# EasyEDA Pro project 4090_Portable_Fan.epro, board PCB1_1
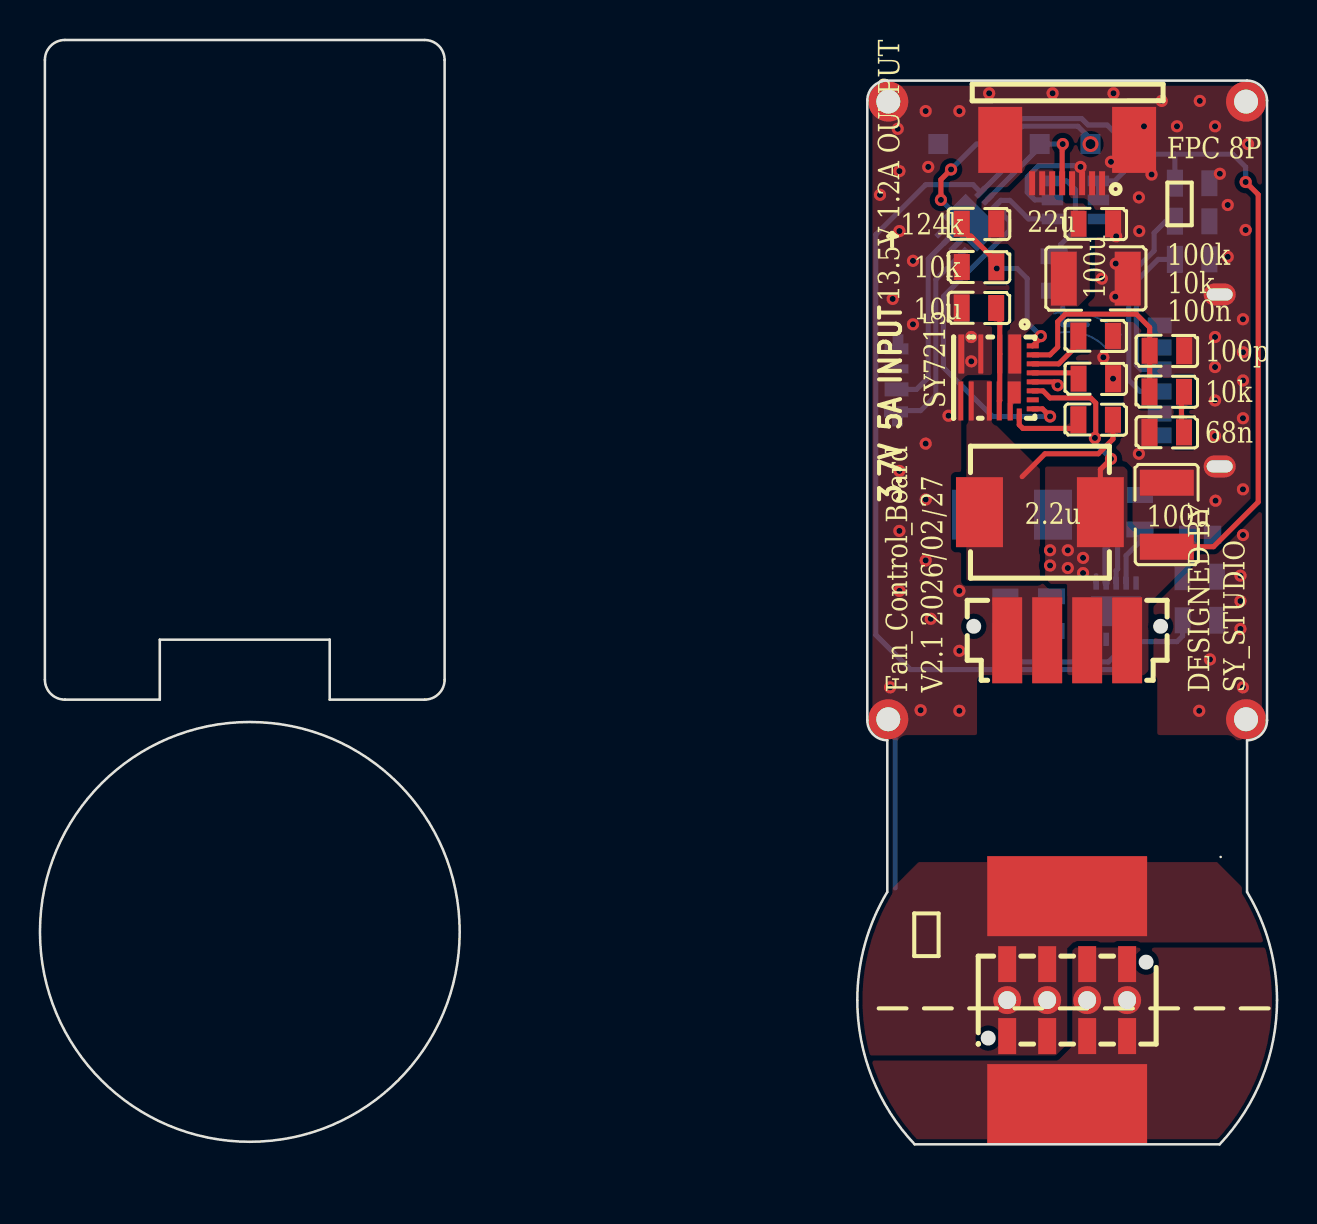
[diagram p12: board, top side]
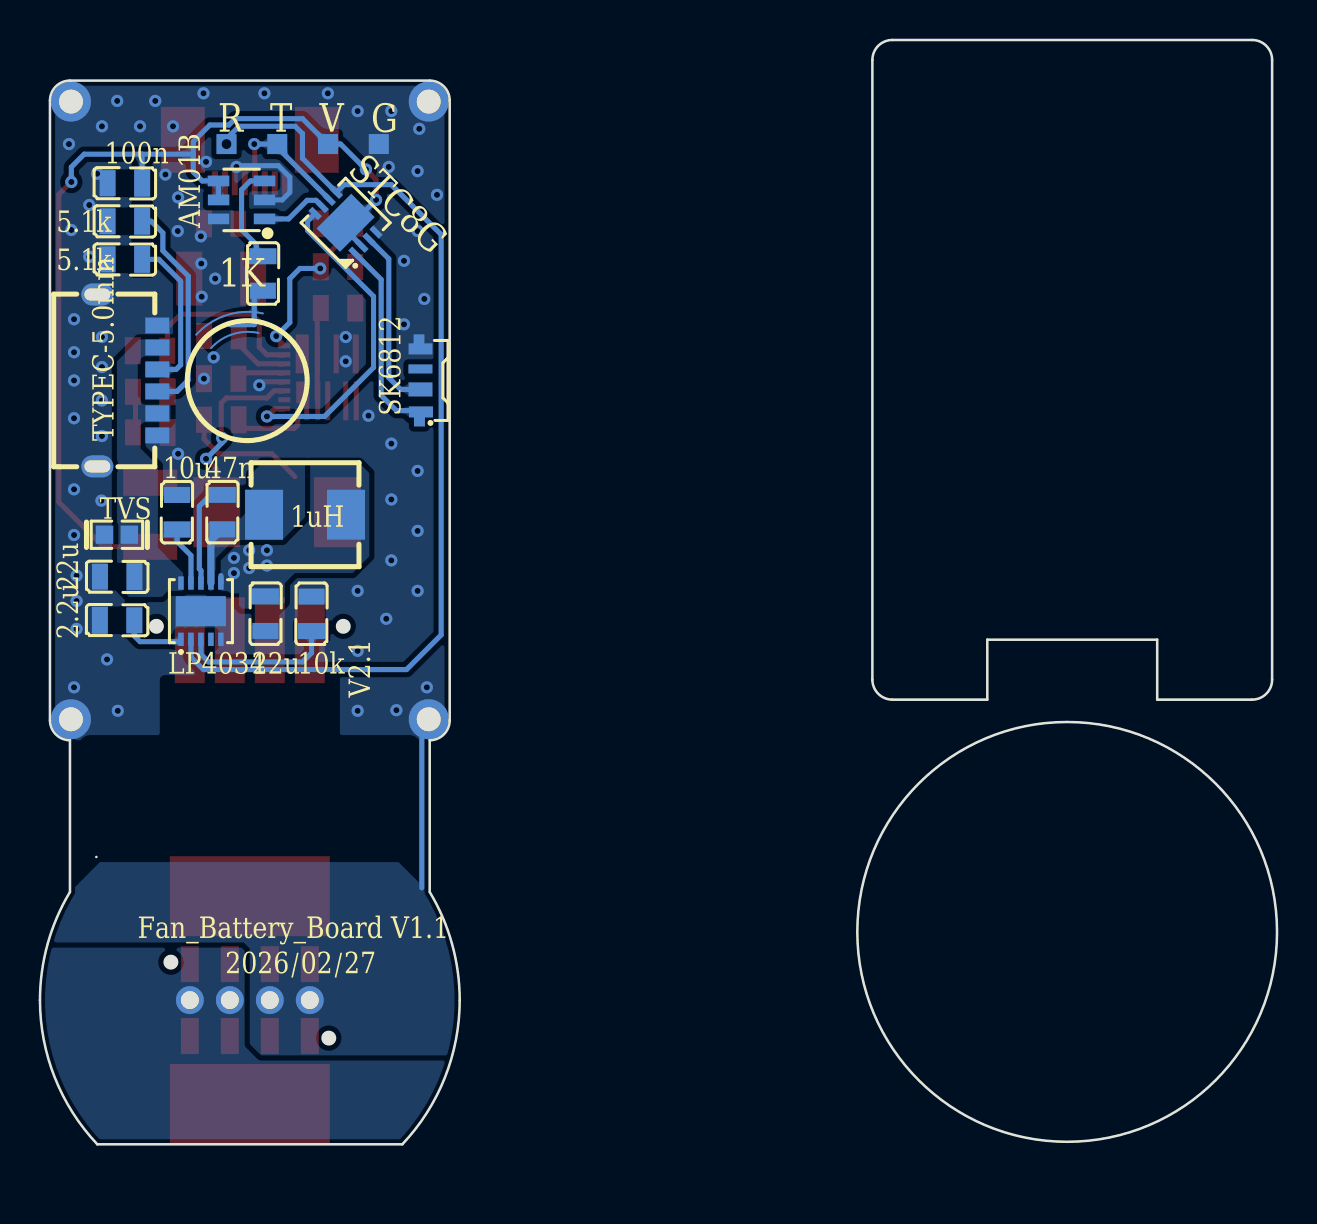
[diagram p13: board, bottom side, seen from below]

Outline 61.89 x 55.25 mm; copper layers: Top Layer, Bottom Layer. Coordinates in mm from the lower left corner of the outline.
Outline path: circle c10.5,10.63 r10.5 ; 0.25,54.25 arc(0.54,54.95) 1.25,55.25 19.25,55.25 arc(19.95,54.95) 20.25,54.25 20.25,23.25 arc(19.95,22.54) 19.25,22.25 14.5,22.25 14.5,25.25 6,25.25 6,22.25 1.25,22.25 arc(0.54,22.54) 0.25,23.25 0.25,54.25 ; 40.89,7.21 arc(41.28,10.02) 42.39,12.62 42.39,20.21 arc(41.69,20.51) 41.39,21.21 41.39,52.21 arc(41.69,52.92) 42.39,53.21 60.39,53.21 arc(61.1,52.92) 61.39,52.21 61.39,21.21 arc(61.1,20.51) 60.39,20.21 60.39,12.62 arc(61.51,10.02) 61.89,7.21 arc(61.15,3.33) 59.02,0 43.76,0 arc(41.64,3.33) 40.89,7.21
Stack: Top Layer 0.035mm / Dielectric1 1.11mm FR4 er 4.5 / Bottom Layer 0.035mm

## Design rules (mm)
spacing copperThickness1oz (default): track to track 0.102, other pairs 0.152 to 0.3
spacing copperThickness2oz: track to track 0.203, other pairs 0.152 to 0.3
spacing Plane_innerPlane: track to track 0.102, other pairs 0.152 to 0.3
spacing Copper_copperRegion: track to track 0.102, other pairs 0.152 to 0.3
track width copperThickness1oz (default): min 0.127, default 0.254, max 2.54
track width copperThickness2oz: min 0.203, default 0.254, max 2.54
differential pair differentialPair (default): width min 0.127, default 0.254, max 2.54; gap min 0.152, default 0.152
net VBAT+ uses copperRegion_copperThickness1oz
net GND uses copperRegion_copperThickness1oz
net VBUS uses copperRegion_copperThickness1oz
pour e232 uses Copper_copperRegion, copperRegion_Copper_copperRegion
net $1N43207 uses copperRegion_copperThickness1oz
net VBAT uses copperRegion_copperThickness1oz
net $1N43171 uses copperRegion_copperThickness1oz
net BS uses copperRegion_copperThickness1oz
pour e263 uses Copper_copperRegion, copperRegion_Copper_copperRegion
pour e266 uses Copper_copperRegion, copperRegion_Copper_copperRegion
net GND1 uses copperRegion_copperThickness1oz

## Placement (name value [footprint] x y rotation side)
C1  100nF  [0805_S]  57.65 48.13 90 bottom
C2  100pF  [0805_S]  56.38 39.75 90 top
C3  68nF  [0805_S]  56.38 35.56 270 top
C4  100uF  [C1210]  56.38 31.5 270 top
C5  100nF  [0805_S]  52.82 36.2 270 top
C6  10uF  [0805_S]  46.98 41.78 270 top
C7  100uF  [C1210]  52.82 43.31 180 top
C8  22uF  [0805_S]  52.82 46.1 90 top
C9  22uF  [0805_S]  58.03 28.45 90 bottom
C10  2.2uF  [0805_S]  58.03 26.16 270 bottom
C11  10uF  [0805_S]  54.98 31.62 180 bottom
C12  47nF  [0805_S]  52.82 31.62 0 bottom
C13  22uF  [0805_S]  50.66 26.54 0 bottom
CON1  GT-BTR20004-0250A-005A  [CONN-SMD_GT-BTR20004-0250A-005A]  51.39 25.21 180 top
CON2  GT-BTP20004-0280A-009A  [CONN-TH_GT-BTP20004-0280A-009A]  51.39 7.21 0 top
FPC1  AFC07-S08ECA-00  [FPC-SMD_P0.5-8P_LCS-SH-H2.0]  51.39 49.16 0 top
L1  2.2uH  [IND-SMD_L7.0-W6.6_MCW-0650-220]  50.03 31.62 180 top
L2  1uH  [IND-SMD_L5.4-W5.2_FXL0530]  48.63 31.5 180 bottom
LED1  SK6812SIDE-A  [LED-SMD_4P-L4.0-W1.6-L]  42.84 38.21 90 bottom
NOREF  -  [Pad_e141]  52.56 50.04 180 top
NOREF#2  -  [Pad_e177]  42.44 21.26 270 top
NOREF#3  -  [Pad_e471]  51.39 2.01 0 top
NOREF#4  -  [Pad_e140]  50.02 50.04 180 top
NOREF#5  -  [Pad_e179]  60.34 52.16 270 top
NOREF#6  -  [Pad_e178]  60.34 21.26 270 top
NOREF#7  -  [Pad_e139]  47.48 50.04 180 top
NOREF#8  -  [Pad_e176]  42.44 52.16 270 top
NOREF#9  -  [Pad_e470]  51.39 12.41 0 top
NOREF#10  -  [Pad_e138]  44.94 50.04 180 top
R1  10K  [0805_S]  56.38 37.59 270 top
R2  1K  [0805_S]  50.79 43.56 0 bottom
R3  10K  [0805_S]  46.98 43.94 90 top
R4  124K  [0805_S]  46.98 46.1 90 top
R6  100K  [0805_S]  52.82 40.39 270 top
R7  10K  [0805_S]  52.82 38.35 90 top
R8  10k  [0805_S]  48.25 26.54 180 bottom
R9  5.1K  [0805_S]  57.65 44.32 90 bottom
R10  5.1K  [0805_S]  57.65 46.23 90 bottom
STC1  STC8G1K08A-36I-DFN8  [DFN-8_L3.0-W3.0-P0.50-BL-EP]  46.6 46.1 135 bottom
TVS1  PESD0603-240  [D0603-BI]  58.04 30.49 180 bottom
U1  AM01B  [SOT-23-6_L2.9-W1.6-P0.95-LS2.8-BL]  51.81 47.24 90 bottom
U2  -  [F9-10-6-0.4喇叭口无针触摸弹簧]  51.39 38.21 162.3 bottom
U3  SY7215ARDC  [QFN-18_L4.0-W4.0_SY7215ARDC]  47.87 38.23 270 top
U4  LP4034QVF  [DFN-10_L3.0-W3.0-P0.50-BL-EP2.5]  53.84 26.67 180 bottom
USBC1  TYPE-C 6P WTL5.0 108  [USB-C-SMD_TYPE-C-6P-WTL5.0-108]  57.52 38.21 270 bottom

## Footprints (pads in the part's own frame, mm; a bottom-side part is the same pattern mirrored in y, then rotated)
0805_S
  rect 1.3x0.8 smd: 1(-0.052,0.86)
  rect 1.35x0.8 smd: 2(-0.052,-0.867)
C1210
  rect 1.3x2.7 smd: 1(-1.6,0) 2(1.6,0)
CONN-SMD_GT-BTR20004-0250A-005A
  rect 1.5x4.3 smd: 1(-3,0) 2(-1,0) 3(1,0) 4(3,0)
CONN-TH_GT-BTP20004-0280A-009A
  rect 0.9x1.8 smd: 1(-3,1.8) 1(-3,-1.8) 2(-1,1.8) 2(-1,-1.8) 3(1,1.8) 3(1,-1.8) 4(3,1.8) 4(3,-1.8)
  round 1.4 hole 0.9: 1(-3,0) 2(-1,0) 3(1,0) 4(3,0)
D0603-BI
  rect 0.873x0.907 smd: 1(-0.622,0) 2(0.622,0)
DFN-8_L3.0-W3.0-P0.50-BL-EP
  rect 0.28x0.665 smd: 1(-0.75,-1.407) 2(-0.25,-1.407) 3(0.25,-1.407) 4(0.75,-1.407) 5(0.75,1.407) 6(0.25,1.407) 7(-0.25,1.407) 8(-0.75,1.407)
  rect 2.45x1.65 smd: 9(0,0)
DFN-10_L3.0-W3.0-P0.50-BL-EP2.5
  rect 0.28x0.665 smd: 1(-1,-1.407) 2(-0.5,-1.407) 3(0,-1.407) 4(0.5,-1.407) 5(1,-1.407) 6(1,1.407) 7(0.5,1.407) 8(0,1.407) 9(-0.5,1.407) 10(-1,1.407)
  rect 2.5x1.5 smd: 11(0,0)
F9-10-6-0.4喇叭口无针触摸弹簧
  custom 3.5x1.335 smd: 1(-0.111,2.965)
FPC-SMD_P0.5-8P_LCS-SH-H2.0
  rect 0.3x1.2 smd: 1(1.748,-1.084) 2(1.248,-1.084) 3(0.748,-1.084) 4(0.248,-1.084) 5(-0.252,-1.084) 6(-0.752,-1.084) 7(-1.252,-1.084) 8(-1.754,-1.083)
  rect 2.2x3.3 smd: 9(3.35,1.084) 10(-3.35,1.084)
IND-SMD_L5.4-W5.2_FXL0530
  rect 1.9x2.5 smd: 1(-2.05,0) 2(2.05,0)
IND-SMD_L7.0-W6.6_MCW-0650-220
  rect 2.35x3.5 smd: 1(-3.025,0) 2(3.025,0)
LED-SMD_4P-L4.0-W1.6-L
  custom 1x1.2 smd: 1(-1.8,-0.013) 4(1.8,0.013)
  custom 0.7x1.2 smd: 2(-0.45,0.013)
  custom 0.45x1.2 smd: 3(0.575,0.013)
Pad_e138
  rect 1x1 smd far side: 2(0,0)
Pad_e139
  rect 1x1 smd far side: 2(0,0)
Pad_e140
  rect 1x1 smd far side: 2(0,0)
Pad_e141
  rect 1x1 smd far side: 2(0,0)
Pad_e176
  round 2 hole 1.2: 1(0,0)
Pad_e177
  round 2 hole 1.2: 1(0,0)
Pad_e178
  round 2 hole 1.2: 1(0,0)
Pad_e179
  round 2 hole 1.2: 1(0,0)
Pad_e470
  rect 8x4 smd: 2(0,0)
Pad_e471
  rect 8x4 smd: 2(0,0)
QFN-18_L4.0-W4.0_SY7215ARDC
  rect 1.95x0.65 smd: 1(-1.31,0.9)
  rect 1.95x0.25 smd: 2(-1.31,0.15) 3(-1.31,-0.8) 5(1.04,-1.8) 6(1.04,-1.275) 7(1.04,-0.375) 8(1.04,0.125)
  rect 1.95x0.3 smd: 4(-1.31,-1.775)
  custom 1.95x0.65 smd: 9(1.04,0.875)
  rect 0.6x0.25 smd: 10(1.715,1.125)
  rect 0.25x0.6 smd: 11(1.435,1.8) 12(0.985,1.8) 13(0.535,1.8) 14(0.085,1.8) 15(-0.365,1.8) 16(-0.815,1.8) 17(-1.265,1.8) 18(-1.715,1.8)
SOT-23-6_L2.9-W1.6-P0.95-LS2.8-BL
  rect 0.532x1.072 smd: 1(-0.95,-1.149) 2(0,-1.149) 3(0.95,-1.149) 4(0.95,1.149) 5(0,1.149) 6(-0.95,1.149)
USB-C-SMD_TYPE-C-6P-WTL5.0-108
  oval 1.1x1.6 hole 0.6x1.3: 7(-4.3,-1.5) 8(4.3,-1.5)
  rect 0.8x1.2 smd: A5(-0.55,1.5) A9(1.65,1.5) A12(2.75,1.5) B5(0.55,1.5) B9(-1.65,1.5) B12(-2.75,1.5)

## Nets
13.5V: C7.2 C8.1 FPC1.6 FPC1.7 FPC1.8 R4.2 U3.1 U3.9
GND: C1.1 C2.2 C3.2 C4.1 C6.2 C7.1 C8.2 C9.1 C10.2 C11.1 C13.1 CON1.3 CON1.4 FPC1.1 FPC1.2 FPC1.3 FPC1.4 FPC1.9 FPC1.10 LED1.4 NOREF#2.1 NOREF#5.1 NOREF#6.1 NOREF#8.1 NOREF#10.2 R3.1 R6.1 R7.2 R8.1 R9.1 R10.1 STC1.4 TVS1.1 U1.2 U1.6 U3.3 U3.4 U3.5 U3.14 U4.5 U4.11 USBC1.7 USBC1.8 USBC1.A12 USBC1.B12
GND1: CON2.3 CON2.4 NOREF#3.2
VBAT: C1.2 C4.2 C13.2 CON1.1 CON1.2 L1.1 L2.2 NOREF#7.2 STC1.2 STC1.9 U1.4 U1.5 U3.13 U4.6
VBAT+: CON2.1 CON2.2 NOREF#9.2
VBUS: C9.2 TVS1.2 U4.10 USBC1.A9 USBC1.B9
BD: C6.1 U3.2 U3.8
BS: C5.2 U3.10
CHRG: NOREF.2 STC1.5 U4.2
COMP: C2.1 R1.2 U3.17
KEY_INT0: STC1.7 U1.1
POWER_ON: STC1.8 U3.11
PWM: FPC1.5 NOREF#4.2 STC1.6
WS2812_PWR: LED1.2 STC1.3
WS2812_SPI: LED1.1 STC1.1
$1N19622: R9.2 USBC1.A5
$1N19624: R10.2 USBC1.B5
$1N43171: C5.1 L1.2 U3.6 U3.7
$1N43181: R6.2 U3.16
$1N43183: R3.2 R4.1 U3.18
$1N43190: R7.1 U3.15
$1N43193: C3.1 R1.1
$1N43198: R2.2 U1.3
$1N43200: R2.1 U2.1
$1N43207: C12.1 L2.1 U4.7
$1N43212: C12.2 U4.8
$1N43213: C11.2 U4.9
$1N43216: R8.2 U4.3
$1N43221: C10.1 U4.1

Pads without a net: LED1 3; U3 12; U4 4

## Via types
v1: diameter 0.61, hole 0.305, Top Layer to Bottom Layer, 83 vias
v2: diameter 0.8, hole 0.5, Top Layer to Bottom Layer, 1 via

## Routing (per net, layer and track width the routed paths; a pad name or vN(x,y) marks a point on that pad's centre or on a via; arc(x,y) is an arc through that point)
GND: length 15.1
  Top Layer w0.254: v1(50.92,37.97) 50.75,38.14 49.67,38.14
  Bottom Layer w0.254: 42.79,12.83 42.79,20.92 NOREF#2.1 ; U1.2 49.78,47.24 49.4,47.63 49.4,48.39 49.97,48.96 51.87,48.96 52.06,48.77
  vias: v1(42.03,47.5) v1(42.54,22.86) v1(42.66,42.29) v1(42.92,50.8) v1(43,48.69) v1(43,45.69) v1(43,33.69) v1(43,30.69) v1(43,27.69) v1(43.68,44.2) v1(43.68,41.02) v1(44.06,21.72) v1(44.31,51.69) v1(44.31,35.05) v1(44.31,32.26) v1(44.31,29.21) v1(44.44,48.9) v1(44.57,26.29) v1(45.46,36.45) v1(46,51.69) v1(46,27.69) v1(46,24.69) v1(46,21.69) v1(46.6,40.39) v1(46.6,39.17) v1(47.49,52.58) v1(50.66,52.58) v1(52.06,48.9) v1(53.13,43.31) v1(53.21,39.37) v1(53.59,49.15) v1(53.71,52.58) v1(53.69,38.3) v1(53.82,44.06) v1(53.8,42.4) v1(53.84,45.42) v1(54.98,47.37) v1(55,45.69) v1(54.98,34.54) v1(55.24,50.93) v1(55.62,48.51) v1(56.13,52.2) v1(56.89,50.93) v1(58.03,52.2) v1(58,21.69) v1(58.54,24.26) v1(58.79,50.93) v1(58.79,40.39) v1(58.79,38.88) v1(58.79,37.21) v1(58.79,35.43) v1(58.82,32.2) v1(59.03,48.55) v1(59.43,46.99) v1(59.43,44.4) v1(60.06,28.45) v1(60.06,27.18) v1(60.06,25.78) v1(60.19,41.28) v1(60.19,39.62) v1(60.19,38.21) v1(60.19,36.32) v1(60.19,32.77) v1(60.19,30.48) v1(60.19,22.86) v1(60.32,45.74) v1(60.44,50.04)
VBAT: length 61.2
  Top Layer w0.254: v1(52.78,35.34) 52.82,35.38 52.82,37.08 52.57,37.34 50.54,37.34 50.18,37.69 49.67,37.69 ; 54.98,23.75 54.39,24.34 CON1.1 ; v1(53.59,34.29) 53.06,33.76 L1.1 ; v1(45.59,48.77) 45.08,48.26 v1(45.08,47.24) ; C4.2 58.72,29.9 60.95,32.13 60.95,47.51 v1(60.32,48.14)
  Bottom Layer w0.254: v1(45.08,47.24) 46.22,46.1 STC1.9 46.6,45.75 STC1.2 ; 54.22,49.53 54.22,48.64 53.77,48.19 52.96,48.19 U1.5 ; 54.22,49.53 56.78,49.53 ; 54.22,49.53 54.22,50.17 53.4,50.99 52.44,50.99 52.12,51.31 48.75,51.31 NOREF#7.2 46.86,50.04 v1(45.59,48.77) ; 56.78,49.53 59.68,49.53 60.32,48.89 v1(60.32,48.14) ; 56.78,49.53 C1.2 ; v1(52.78,35.34) 52.78,35.09 v1(53.59,34.29) ; U4.6 52.84,28.45
  vias: v1(50.54,29.72) v1(50.54,28.96) v1(51.43,29.72) v1(51.43,28.83) v1(52.19,29.34) v1(52.19,28.58)
BD: length 4.7
  Top Layer w0.254: U3.8 48.02,37.21 U3.2 48.02,41.66 C6.1
BS: length 3.9
  Top Layer w0.254: 49,36.51 49,35.99 49.18,35.81 51.81,35.81 51.96,35.96 C5.2
CHRG: length 49
  Bottom Layer w0.254: v2(52.56,50.04) 52.56,50.3 51.94,50.93 49.12,50.93 48.76,50.56 48.76,49.32 STC1.5 46.69,48.01 44.31,48.01 41.82,45.51 41.82,25.48 43.55,23.75 53.71,23.75 54.34,24.38 U4.2
COMP: length 10.9
  Top Layer w0.254: 49.67,39.49 50.53,39.49 50.92,39.88 50.92,41.15 51.3,41.53 54.86,41.53 55.52,40.87 C2.1 55.52,37.65 R1.2
KEY_INT0: length 3.4
  Bottom Layer w0.254: STC1.7 48.08,47.22 48.53,47.22 49.46,46.29 U1.1
POWER_ON: length 16.6
  Top Layer w0.254: 49.67,36.79 50.16,36.79 v1(50.54,36.41)
  Bottom Layer w0.254: v1(50.54,36.41) 47.66,36.41 45.2,38.86 45.2,42.42 48.51,45.72 48.51,46.19 STC1.8
PWM: length 7
  Top Layer w0.254: FPC1.5 51.14,50.01 v1(51.17,50.04)
  Bottom Layer w0.254: v1(51.17,50.04) NOREF#4.2 50.02,49.88 STC1.6
WS2812_PWR: length 9.2
  Bottom Layer w0.254: 45.43,45.28 44.44,44.3 44.44,38.35 43.85,37.76 LED1.2
WS2812_SPI: length 10.1
  Bottom Layer w0.254: STC1.1 44.82,43.26 44.82,37.47 44.06,36.7 43.12,36.7 LED1.1
$1N19622: length 7.8
  Bottom Layer w0.254: R9.2 55.95,44.27 54.86,43.18 54.86,38.99 55.08,38.76 USBC1.A5
$1N19624: length 11
  Bottom Layer w0.254: R10.2 56.33,46.18 55.75,45.59 55.75,44.7 54.47,43.43 54.47,38.23 55.04,37.66 USBC1.B5
$1N43171: length 6.3
  Top Layer w0.254: C5.1 53.68,35.28 52.95,34.54 50.28,34.54 49.14,33.4
$1N43181: length 3.1
  Top Layer w0.254: 49.67,39.04 50.97,39.04 51.96,40.03 R6.2
$1N43183: length 8.5
  Top Layer w0.254: R4.1 46.22,45.95 46.22,45.69 46.47,45.44 46.58,45.44 47.85,44.17 47.85,43.89 ; v1(50.08,40.43) 50.08,40.35 49.67,39.94
  Bottom Layer w0.254: v1(50.08,40.43) 49.4,41.11 49.4,43.31 48.89,43.82 v1(47.87,43.82)
$1N43190: length 2.4
  Top Layer w0.254: 49.67,38.59 51.67,38.59 R7.1
$1N43193: length 1.4
  Top Layer w0.254: 57.11,36.25 57.11,37.52 R1.1
$1N43198: length 4.7
  Bottom Layer w0.254: 51.07,44.65 51.07,45.01 51.81,45.75 51.81,47.75 51.37,48.19 50.66,48.19
$1N43200: length 3.3
  Bottom Layer w0.254: U2.1 51.17,41 51.17,42.55 51.02,42.7 R2.1
$1N43207: length 2.9
  Bottom Layer w0.36: C12.1 53.34,30.2 U4.7
$1N43212: length 5.3
  Bottom Layer w0.254: C12.2 53.35,32.49 53.92,31.92 53.92,28.78 53.84,28.7 U4.8
$1N43213: length 3
  Bottom Layer w0.254: 55.04,30.76 55.04,30.15 54.34,29.46 U4.9
$1N43216: length 7.7
  Bottom Layer w0.254: R8.2 48.3,24.59 48.76,24.13 53.46,24.13 53.84,24.51 U4.3
$1N43221: length 3.3
  Bottom Layer w0.254: C10.1 57.17,25.43 56.89,25.15 54.96,25.15 U4.1

## Copper pours and planes (outline as drawn; the poured copper is in the pictures)
13.5V on Top Layer: 48.38,36.2 48.38,40.64 48.76,41.02 48.76,44.7 48.42,45.04 47.66,45.04 47.11,45.59 47.11,47.13 47.6,47.63 48.51,47.63 49.52,48.64 49.52,48.77 50.66,48.77 50.9,48.53 50.9,47.47 51.31,47.07 52.19,47.07 52.52,46.74 52.52,42.5 51.75,41.73 50.86,41.73 50.15,41.02 49.45,41.02 49.1,40.67 49.1,36.24 49.06,36.2
13.5V on Top Layer: 48.53,41.23 49.9,41.23 49.9,40.39 48.53,40.39
GND on Top Layer: 41.39,53.21 61.39,53.21 61.39,20.21 41.39,20.21
GND on Bottom Layer: 41.39,53.21 61.39,53.21 61.39,20.21 41.39,20.21
GND1 on Top Layer: 41.26,4.48 51.04,4.48 51.39,4.83 51.39,9.49 52,10.1 62.54,10.1 62.73,9.91 62.73,1.91 60.7,-0.13 42.16,-0.13 41.26,0.77
GND1 on Bottom Layer: 41.21,4.58 51,4.58 51.34,4.93 51.34,9.59 51.95,10.2 62.49,10.2 62.68,10.01 62.68,2.01 60.65,-0.02 42.11,-0.02 41.21,0.88
VBAT on Top Layer: 54.98,23.21 51.39,23.21 51.39,27.98 51.33,28.04 50.57,28.04 50.03,28.58 50.03,33.64 50.3,33.91 54.23,33.91 54.41,33.73 54.41,30.95 54.87,30.49 57.72,30.49 57.73,29.29 55.45,27.01 55.45,23.68
VBAT on Bottom Layer: 45.93,34.1 48.4,34.1 48.4,31.3 49.71,29.99 52.18,29.99 53.01,29.15 53.01,27.74 52.82,27.56 51.94,27.56 51.81,27.69 51.81,27.94 51.17,28.58 46.25,28.58 45.42,29.41 45.42,33.58
VBAT on Bottom Layer: 51.94,26.92 51.81,26.8 49.96,26.8 49.65,27.11 49.65,28.07 48.96,28.76 51.2,28.76 51.33,28.9 51.65,28.58 51.68,28.58 51.94,28.32
VBAT+ on Top Layer: 60.39,14.36 62.6,12.14 62.6,10.92 61.78,10.1 51.69,10.1 51.39,9.8 51.39,5.01 50.83,4.45 39.36,4.45 39.36,11.43 42.29,14.36
VBAT+ on Bottom Layer: 60.39,14.36 62.6,12.14 62.6,10.92 61.78,10.1 51.69,10.1 51.39,9.8 51.39,5.01 50.83,4.45 39.36,4.45 39.36,11.43 42.29,14.36
VBUS on Bottom Layer: 56.94,40.26 58.04,39.16 58.04,27.99 57.44,27.38 55.79,27.38 55.49,27.69 54.73,27.69 54.73,28.58 55.24,29.08 55.24,29.08 56,29.85 56,33.95 56.86,34.81 56.86,35.97 56.76,36.07 55.49,36.07 55.36,36.2 55.36,36.96 55.49,37.08 56.63,37.08 57,37.45 57,39 56.69,39.31 55.42,39.31 55.36,39.37 55.36,40.26
$1N43171 on Top Layer: 50.03,28.32 49.9,28.19 46.35,28.19 46.35,33.78 46.35,33.79 46.35,38.11 46.47,38.23 47.62,38.23 47.74,38.1 47.74,36.07 50.03,33.78
$1N43207 on Bottom Layer: 48.63,34.1 50.77,34.1 51.33,33.54 51.33,31.84 51.94,31.24 53.3,31.24 53.65,30.89 53.65,27.87 53.46,27.69 53.21,27.69 53.11,27.79 53.11,29.31 52.19,30.23 49.78,30.23 48.63,31.37

Small or netless copper shapes (teardrops, artwork), in the pictures only: 20 on Top Layer, 44 on Bottom Layer

## Text on the board
Bottom Silkscreen Layer: SK6812 | V2.1 | AM01B | TYPEC-5.0mm | 22u | 2.2u | 10k | 1uH | 47n | LP4034 | 10u | Fan_Battery_Board V1.1 / 2026/02/27 | 100n | TVS | 5.1k | STC8G | G | V | T | 1K | R
Top Silkscreen Layer: --------- | 124k | 10k | 10u | 2.2u | 22u | 100u | FPC 8P | 100k | 100n | 100p | 68n | 13.5V 1.2A OUTPUT | 3.7V 5A INPUT    → | Fan_Control_Board / V2.1 2026/02/27 | SY7215 | DESIGNED BY / SY_STUDIO | ①
